# EAGLE schematic Hephaestus v1 (EAGLE 7.4.0)
AUTHOR: Jordan Jones; DOCNUM: 1; ORGANIZATION: CAL POLY IGVC; REV: 1.0.1
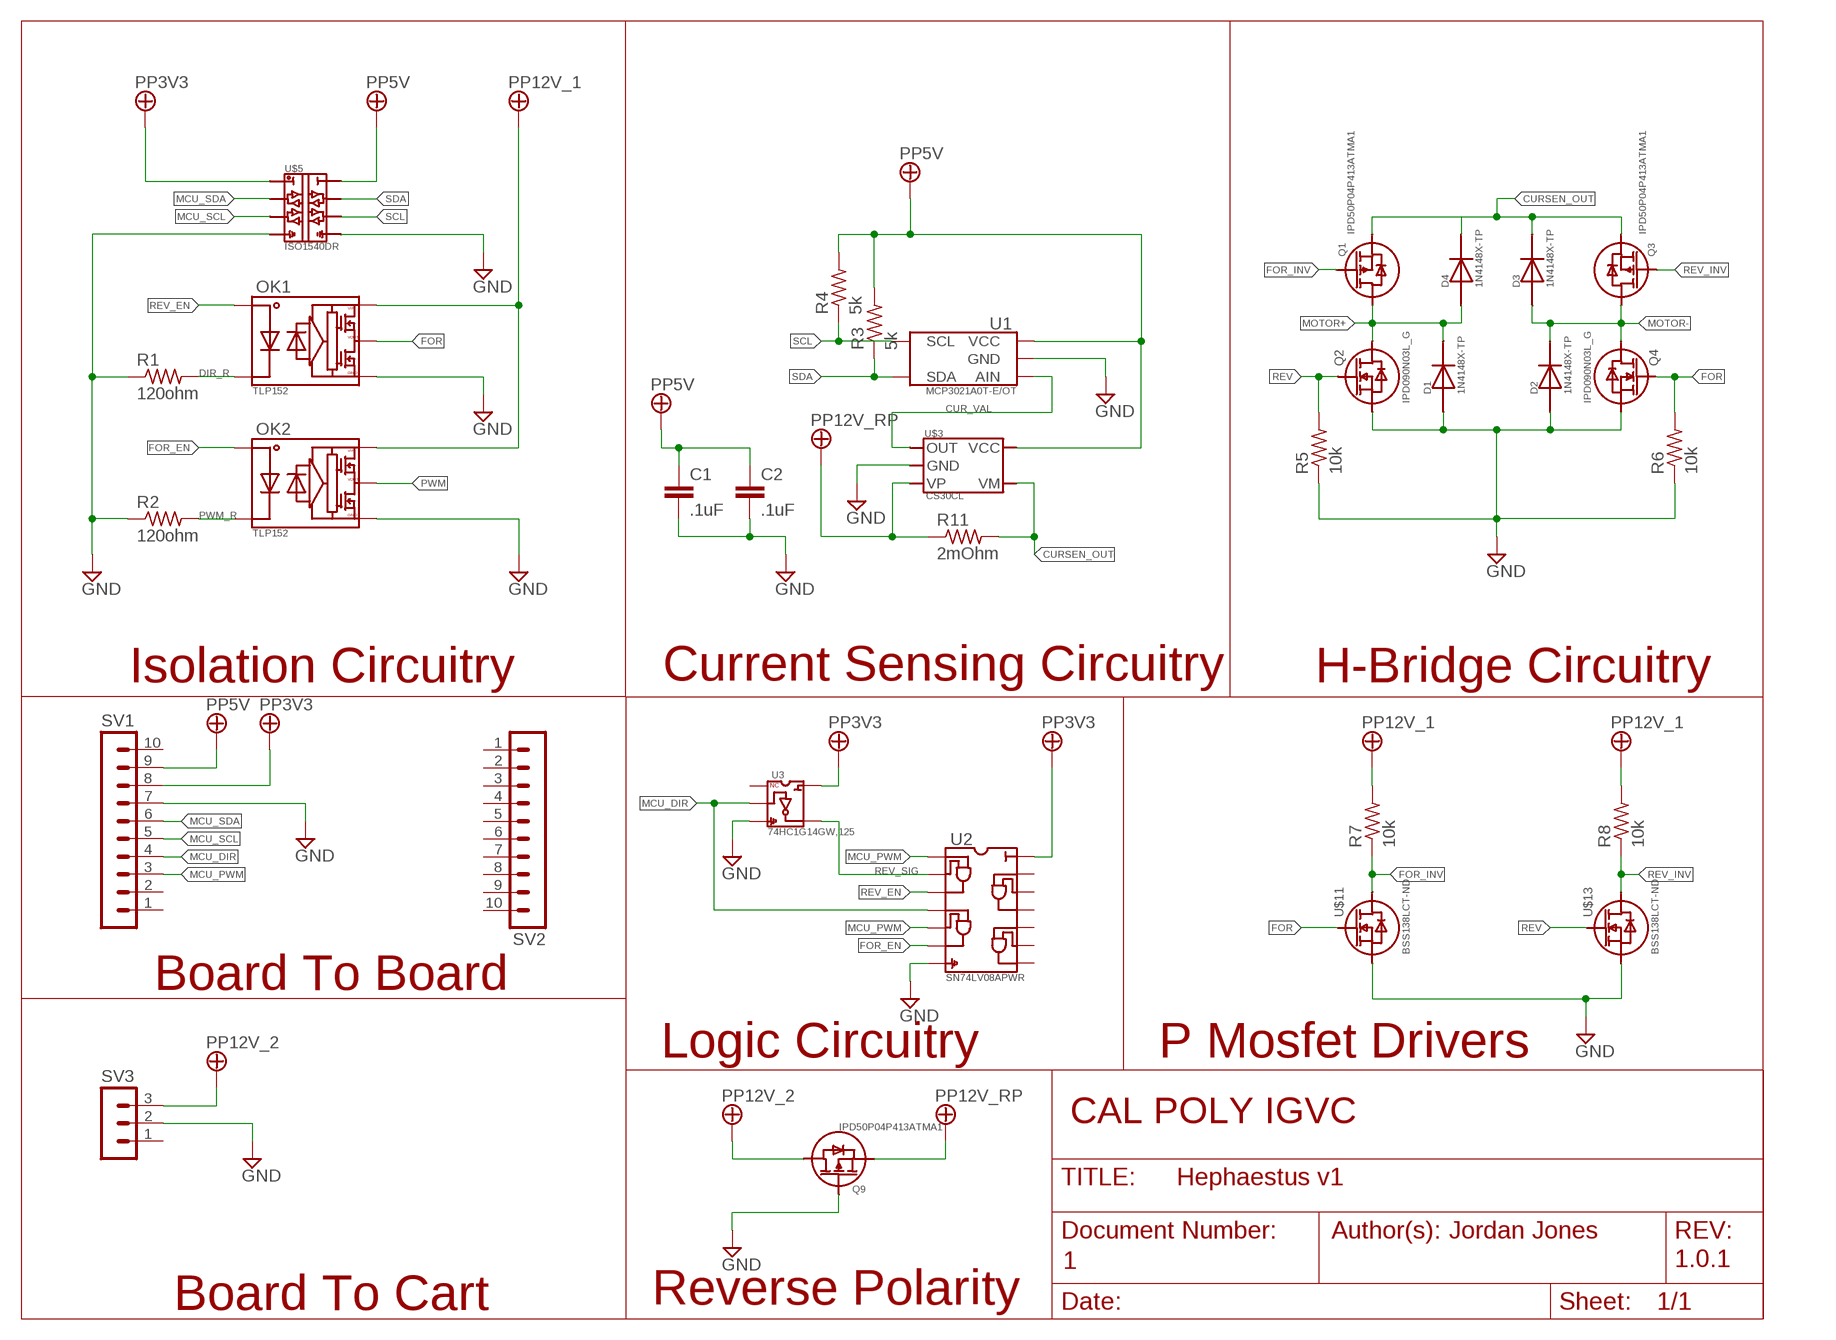
[diagram p0: schematic, sheet 1]

## Parts
C1  .1uF  C-EUC0603  [C0603]
C2  .1uF  C-EUC0603  [C0603]
D1  1N4148X-TP  [SOD523_SC79]
D2  1N4148X-TP  [SOD523_SC79]
D3  1N4148X-TP  [SOD523_SC79]
D4  1N4148X-TP  [SOD523_SC79]
OK1  TLP152  [SOIC-6-5]
OK2  TLP152  [SOIC-6-5]
Q1  IPD50P04P413ATMA1  [TO-252-3]
Q2  IPD090N03L_G  [TO-252-3]
Q3  IPD50P04P413ATMA1  [TO-252-3]
Q4  IPD090N03L_G  [TO-252-3]
Q9  IPD50P04P413ATMA1  [TO-252-3]
R1  120ohm  R-US_R0603  [R0603]
R2  120ohm  R-US_R0603  [R0603]
R3  5k  R-US_R0603  [R0603]
R4  5k  R-US_R0603  [R0603]
R5  10k  R-US_R0603  [R0603]
R6  10k  R-US_R0603  [R0603]
R7  10k  R-US_R0603  [R0603]
R8  10k  R-US_R0603  [R0603]
R11  2mOhm  R-US_R2512  [R2512]
SV1  MA10-1  [MA10-1]
SV2  MA10-1  [MA10-1]
SV3  MA03-1  [MA03-1]
U1  MCP3021A0T-E/OT  [SOT-23-5]
U2  SN74LV08APWR  [TSSOP-14]
U3  74HC1G14GW,125  [SOT-353]
U$3  CS30CL  [SOT-23-5]
U$5  ISO1540DR  [SO-8]
U$11  BSS138LCT-ND  [SOT-23-3]
U$13  BSS138LCT-ND  [SOT-23-3]

## Nets
+5V: U$5.P$8 ; supply symbol labelled PP5V
+12V_RP: OK1.P$6 OK2.P$6 Q9.P$2(S) R11.1 U$3.P$3(VP) ; supply symbol labelled PP12V_1, PP12V_RP
CUR_VAL: U1.P$3(AIN) U$3.P$1(OUT)
CURSEN_OUT: D3.P$2 D4.P$2 Q1.P$2(S) Q3.P$2(S) R11.2 U$3.P$4(VM)
DIR_R: OK1.P$3 R1.2
FOR: OK1.P$5 Q4.P$1(G) R6.2 U$11.P$1(G)
FOR_EN: OK2.P$1 U2.P$6
FOR_INV: Q1.P$1(G) R7.1 U$11.P$3(D)
GND: C1.2 C2.2 D1.P$1 D2.P$1 OK1.P$4 OK2.P$4 Q2.P$2(S) Q4.P$2(S) Q9.P$1(G) R1.1 R2.1 R5.1 R6.1 SV1.7 SV3.2 U1.P$2(GND) U2.P$7 U3.P$3 U$3.P$2(GND) U$5.P$4 U$5.P$5 U$11.P$2(S) U$13.P$2(S)
MCU_DIR: SV1.4 U2.P$4 U3.P$2
MCU_PWM: SV1.3 U2.P$1 U2.P$5
MCU_SCL: SV1.5 U$5.P$3
MCU_SDA: SV1.6 U$5.P$2
MOTOR+: D1.P$2 D4.P$1 Q1.P$3(D) Q2.P$3(D)
MOTOR-: D2.P$2 D3.P$1 Q3.P$3(D) Q4.P$3(D)
PP3V3: SV1.8 U2.P$14 U3.P$5 U$5.P$1
PP5V: C1.1 C2.1 R3.2 R4.2 SV1.9 U1.P$1(VCC) U$3.P$6(VCC)
PP12V_1: R7.2 R8.2
PP12V_2: Q9.P$3(D) SV3.3
PWM: OK2.P$5
PWM_R: OK2.P$3 R2.2
REV: Q2.P$1(G) R5.2 U$13.P$1(G)
REV_EN: OK1.P$1 U2.P$3
REV_INV: Q3.P$1(G) R8.1 U$13.P$3(D)
REV_SIG: U2.P$2 U3.P$4
SCL: R4.1 U1.P$6(SCL) U$5.P$6
SDA: R3.1 U1.P$4(SDA) U$5.P$7
Unconnected: SV1.1 SV1.2 SV1.10 SV2.1 SV2.2 SV2.3 SV2.4 SV2.5 SV2.6 SV2.7 SV2.8 SV2.9 SV2.10 SV3.1 U2.P$8 U2.P$9 U2.P$10 U2.P$11 U2.P$12 U2.P$13 U3.P$1

## Notes on the sheet
- Isolation Circuitry | Current Sensing Circuitry | H-Bridge Circuitry
- Board To Board
- Logic Circuitry | P Mosfet Drivers
- Board To Cart | Reverse Polarity

## Library data of the parts
C1 C2 = resistor:C-EU: CAPACITOR, European symbol
D1-D4 = CP-Discrete:1N4148X-TP: Diode; SOURCE: Digikey
OK1 OK2 = CP-Discrete:TLP152: Optoisolator; SOURCE: Digikey
Q1 Q3 Q9 = CP-Discrete:IPD50P04P413ATMA1: PMOSFET 40V 50A 12.6mOhm @ 10 V 58W; SOURCE: Digikey
Q2 Q4 = CP-Discrete:IPD090N03L_G: NMosfet 30V 40A 9mOhm @ 10V 42W; DIGIKEYPART: IPD090N03LGINCT-ND
R1-R8 R11 = resistor:R-US_: RESISTOR, American symbol
SV1 SV2 = con-lstb:MA10-1: PIN HEADER; OC_FARNELL: unknown; OC_NEWARK: unknown
SV3 = con-lstb:MA03-1: PIN HEADER; OC_FARNELL: unknown; OC_NEWARK: unknown
U1 = CP-IC:MCP3021A0T-E/OT: Single I2C 10Bit ADC
U2 = CP-IC:SN74LV08APWR: Quad Two Input AND
U3 = CP-IC:74HC1G14GW,125: Single One Input NOT CMOS edition; DIGIKEYPART: 568-7749-1-ND
U$3 = CP-IC:CS30CL: Current Sensing IC
U$5 = CP-IC:ISO1540DR: Bidirectional Isolator
U$11 U$13 = CP-Discrete:BSS138LCT-ND: 50V .2A 2.78 Ohm @ 10V GS .35W; DIGIKEYPART: BSS138LCT-ND